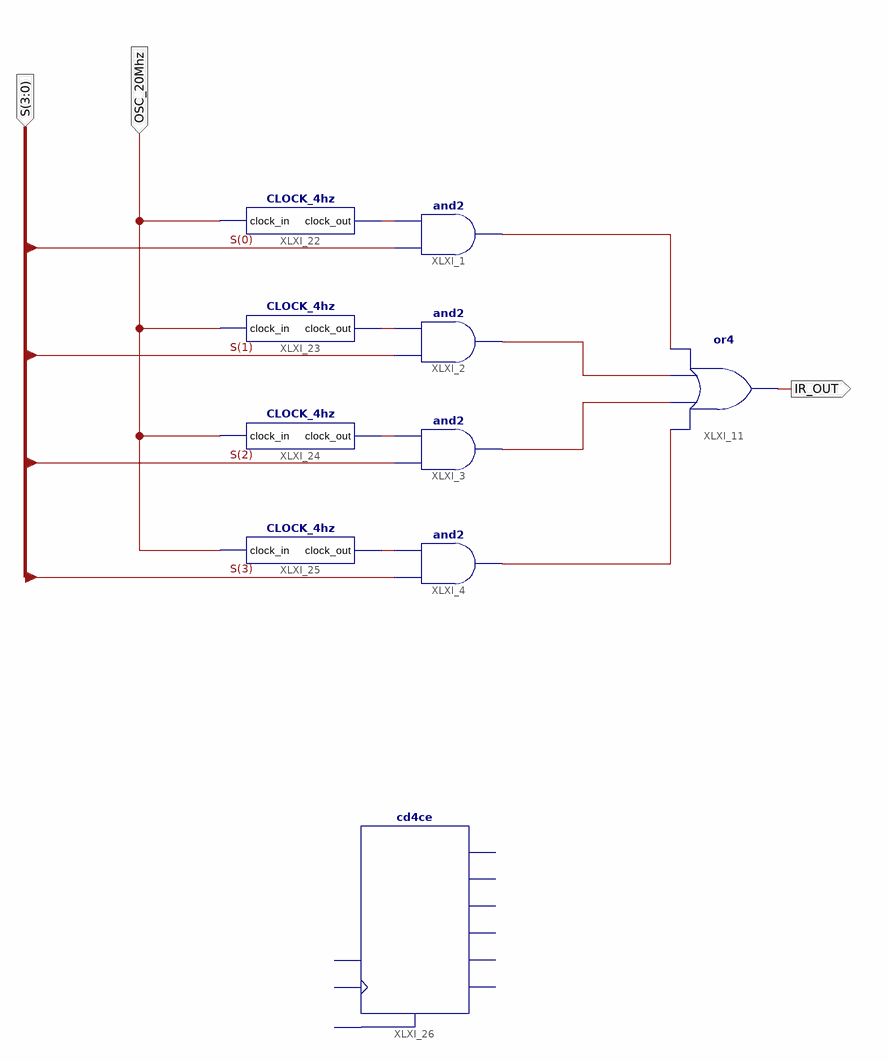
[diagram p0: schematic sheet 1]
// Xilinx ISE schematic IR_Controller.sch (spartan6) as structural Verilog: 10 symbols, 3 ports
module IR_Controller (
  input  [3:0] S,
  input  OSC_20Mhz,
  output IR_OUT
);

  wire XLXN_7, XLXN_8, XLXN_9, XLXN_10, XLXN_19, XLXN_20, XLXN_21, XLXN_22;

  and XLXI_1 (XLXN_19, S[0], XLXN_7);
  and XLXI_2 (XLXN_20, S[1], XLXN_8);
  and XLXI_3 (XLXN_21, S[2], XLXN_9);
  and XLXI_4 (XLXN_22, S[3], XLXN_10);
  or XLXI_11 (IR_OUT, XLXN_22, XLXN_21, XLXN_20, XLXN_19);
  CLOCK_4hz XLXI_22 (.clock_in(OSC_20Mhz), .clock_out(XLXN_7));
  CLOCK_4hz XLXI_23 (.clock_in(OSC_20Mhz), .clock_out(XLXN_8));
  CLOCK_4hz XLXI_24 (.clock_in(OSC_20Mhz), .clock_out(XLXN_9));
  CLOCK_4hz XLXI_25 (.clock_in(OSC_20Mhz), .clock_out(XLXN_10));
  cd4ce XLXI_26 ();  // open: C, CE, CLR, CEO, Q0, Q1, Q2, Q3, TC
endmodule
